# EAGLE schematic KSP8 Power Supply Board v48 (EAGLE 9.7.0)
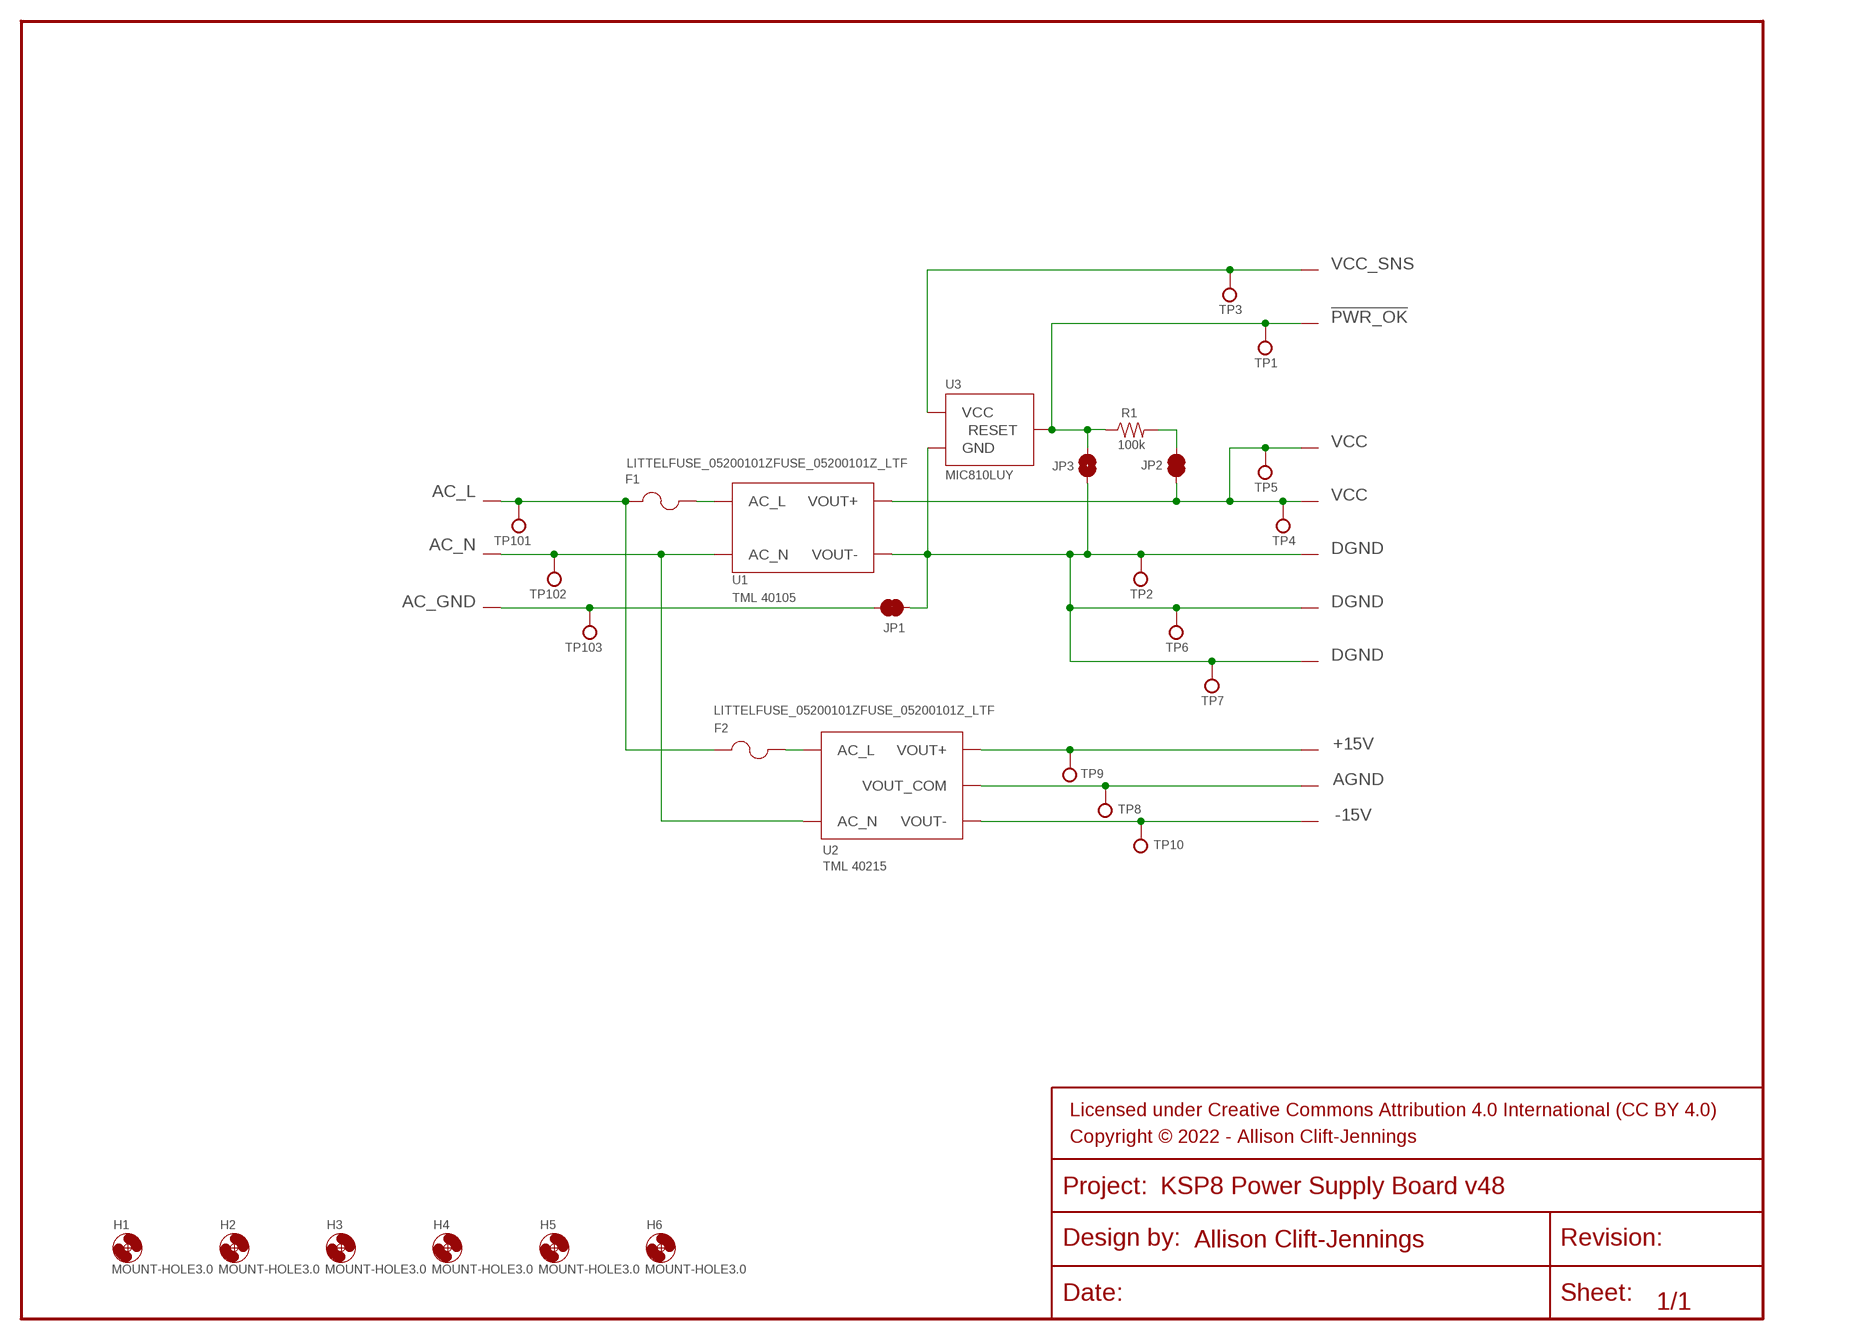
[diagram p0: schematic, sheet 1]

## Parts
AGND  PADPAD-070-LOOP  PAD067-LOOP  [PAD-067-LOOP]
F1  LITTELFUSE_05200101ZFUSE_05200101Z_LTF  [LITTELFUSE_05200101Z_LTF]
F2  LITTELFUSE_05200101ZFUSE_05200101Z_LTF  [LITTELFUSE_05200101Z_LTF]
FRAME1  FRAME-LETTER-OS  [CREATIVE_COMMONS]
H1  MOUNT-HOLE3.0  [3,0]
H2  MOUNT-HOLE3.0  [3,0]
H3  MOUNT-HOLE3.0  [3,0]
H4  MOUNT-HOLE3.0  [3,0]
H5  MOUNT-HOLE3.0  [3,0]
H6  MOUNT-HOLE3.0  [3,0]
JP1  JUMPER-SMT_2_NO_SILK  JUMPER-SMT_2_NC_TRACEHC  [SMT-JUMPER_2_NC_TRACE_SILK_HC]
JP2  JUMPER-SMT_2_NC_TRACE_SILK  [SMT-JUMPER_2_NC_TRACE_SILK]
JP3  JUMPER-SMT_2_NO_SILK  [SMT-JUMPER_2_NO_SILK]
R1  100k  RESISTOR1206  [1206]
TP1  TESTPOINT  [PAD-100-RND]
TP2  TESTPOINT  [PAD-100-RND]
TP3  TESTPOINT  [PAD-100-RND]
TP4  TESTPOINT  [PAD-100-RND]
TP5  TESTPOINT  [PAD-100-RND]
TP6  TESTPOINT  [PAD-100-RND]
TP7  TESTPOINT  [PAD-100-RND]
TP8  TESTPOINT  [PAD-100-RND]
TP9  TESTPOINT  [PAD-100-RND]
TP10  TESTPOINT  [PAD-100-RND]
TP101  TESTPOINT  [PAD-100-RND]
TP102  TESTPOINT  [PAD-100-RND]
TP103  TESTPOINT  [PAD-100-RND]
U1  TML 40105  TRACO_TML_40105  [TRACO_TML]
U2  TML 40215  TRACO_TML_40215  [TRACO_TML]
U3  MIC810LUY  MIC810  [SOT23]
U$4  PADPAD-070-LOOP  PAD067-LOOP  [PAD-067-LOOP]
U$5  PADPAD-070-LOOP  PAD067-LOOP  [PAD-067-LOOP]
U$6  PADPAD-070-LOOP  PAD067-LOOP  [PAD-067-LOOP]
U$7  PADPAD-070-LOOP  PAD067-LOOP  [PAD-067-LOOP]
U$8  PADPAD-070-LOOP  PAD067-LOOP  [PAD-067-LOOP]
U$9  PADPAD-070-LOOP  PAD067-LOOP  [PAD-067-LOOP]
U$10  PADPAD-070-LOOP  PAD067-LOOP  [PAD-067-LOOP]
U$11  PADPAD-070-LOOP  PAD067-LOOP  [PAD-067-LOOP]
U$12  PADPAD-070-LOOP  PAD067-LOOP  [PAD-067-LOOP]
U$13  PADPAD-070-LOOP  PAD067-LOOP  [PAD-067-LOOP]
U$14  PADPAD-070-LOOP  PAD067-LOOP  [PAD-067-LOOP]
U$15  PADPAD-070-LOOP  PAD067-LOOP  [PAD-067-LOOP]

## Nets
!PWR_OK: JP3.2 R1.1 TP1.P$1 U3.2(RESET) U$8.P$1
+15V: TP9.P$1 U2.P$4(VOUT+) U$6.P$1
-15V: TP10.P$1 U2.P$8(VOUT-) U$7.P$1
AC_GND: JP1.1 TP103.P$1 U$11.P$1
AC_L: F1.1 F2.1 TP101.P$1 U$4.P$1
AC_N: TP102.P$1 U1.P$3(AC_N) U2.P$3(AC_N) U$5.P$1
AGND: AGND.P$1 TP8.P$1 U2.P$6(VOUT_COM)
DGND: JP1.2 JP3.1 TP2.P$1 TP6.P$1 TP7.P$1 U1.P$6(VOUT-) U3.1(GND) U$10.P$1 U$13.P$1 U$14.P$1
N$1: F1.2 U1.P$2(AC_L)
N$2: F2.2 U2.P$2(AC_L)
N$4: JP2.1 R1.2
VCC: JP2.2 TP4.P$1 TP5.P$1 U1.P$4(VOUT+) U$9.P$1 U$15.P$1
VCC_SNS: TP3.P$1 U3.3(VCC) U$12.P$1

## Library data of the parts
AGND U$4-U$15 = Tonic Library:PAD
F1 F2 = Tonic Library:LITTELFUSE_05200101Z; COPYRIGHT: Copyright (C) 2022 Ultra Librarian. All rights reserved.; MANUFACTURER_PART_NUMBER: 05200101Z; MFR_NAME: Littelfuse Inc
FRAME1 = Tonic Library:FRAME-LETTER-OS: Schematic Frame - Letter Standard 8.5x11 US Letter frame
H1-H6 = Tonic Library:MOUNT-HOLE: MOUNTING HOLE with drill center marker
JP1 JP2 = Tonic Library:JUMPER-SMT_2_NC_TRACE: Normally closed trace jumper This jumper has a trace between two pads so it's normally closed (NC). Use a razor knife to open the connection. For best results follow the IPC guidelines for cutting traces: Cutout at least 0.063 mm (0.005 in). Remove all loose material to clean up the cut area. Seal the cut with an approved epoxy. Reapply solder to reclose the connection.
JP3 = Tonic Library:JUMPER-SMT_2_NO: Normally open jumper This jumper has two pads in close proximity to each other. Apply solder to close the connection. Round pads are easier to solder for beginners, but are a lot larger. SparkFun Product that uses the round pads: SparkFun EL Sequencer <https://www.sparkfun.com/products/12781>
R1 = Tonic Library:RESISTOR: Resistor Basic schematic elements and footprints for 0603, 1206, and PTH resistors.
TP1-TP10 TP101-TP103 = Tonic Library:TESTPOINT
U1 = Tonic Library:TRACO_TML_40105
U2 = Tonic Library:TRACO_TML_40215
U3 = Tonic Library:MIC810